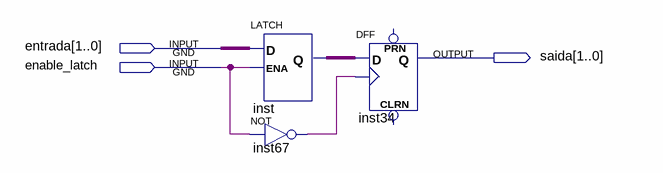
[diagram p0: schematic sheet]
// Quartus schematic Barramento_2x.bdf as structural Verilog: 3 symbols, 3 pins
module Barramento_2x (
  input  [1:0] entrada,
  input  enable_latch,
  output [1:0] saida
);

  wire inst67_out;
  wire [1:0] inst_q;

  LATCH inst[1:0] (.D(entrada), .ENA(enable_latch), .Q(inst_q));
  not inst67 (inst67_out, enable_latch);
  DFF inst34[1:0] (.CLK(inst67_out), .D(inst_q), .Q(saida));  // open: CLRN, PRN
endmodule
